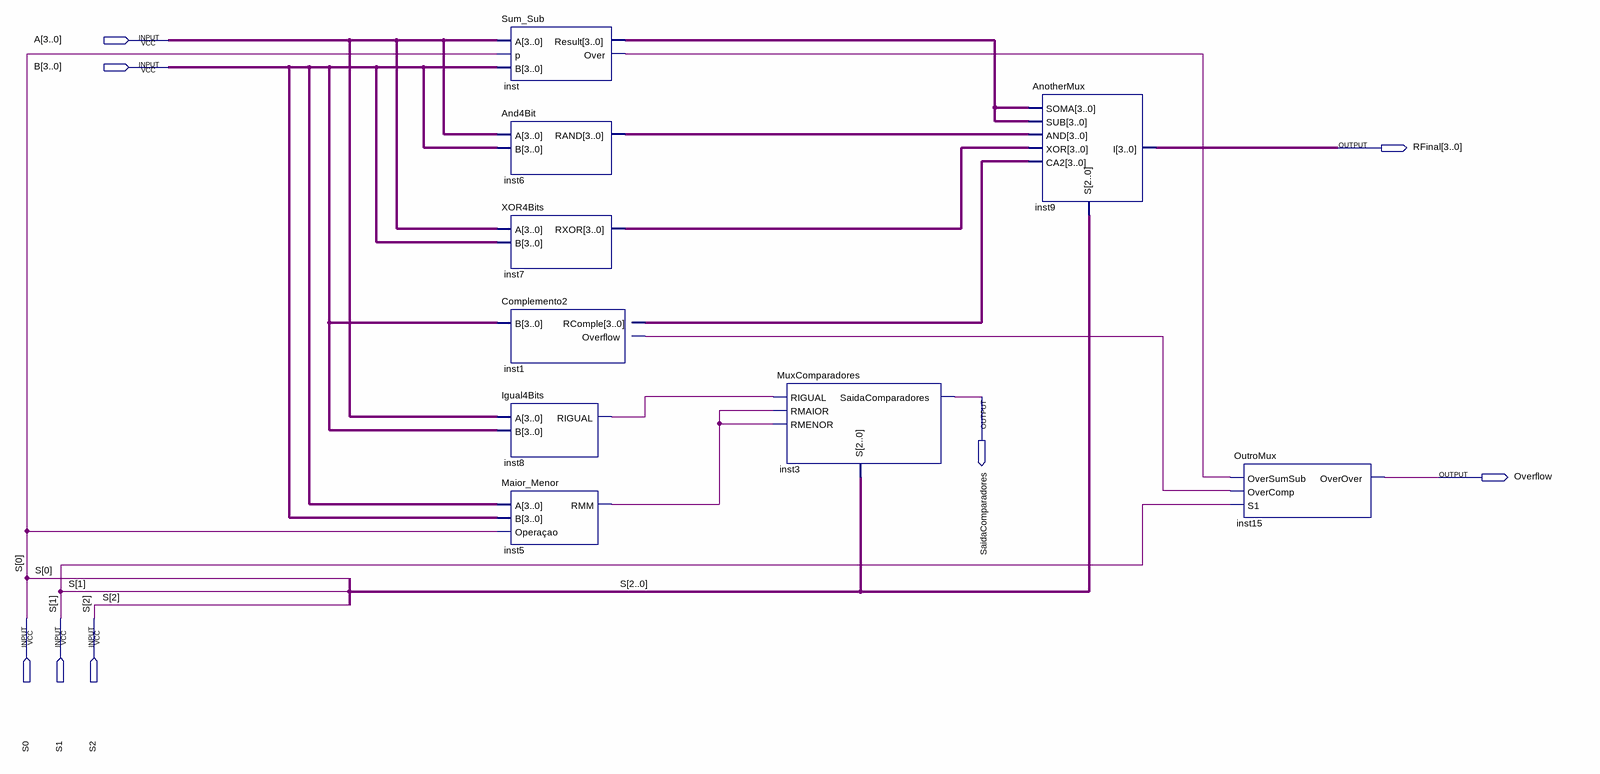
[diagram p0: schematic sheet]
// Quartus schematic ULATOR.bdf as structural Verilog: 9 symbols, 8 pins
module ULATOR (
  input  [3:0] A,
  input  [3:0] B,
  input  S0,
  input  S1,
  input  S2,
  output [3:0] RFinal,
  output SaidaComparadores,
  output Overflow
);

  wire inst1_overflow, inst5_rmm, inst8_rigual, inst_over;
  wire [3:0] inst1_rcomple, inst6_rand, inst7_rxor, inst_result;

  Sum_Sub inst (.A(A), .p(S0), .B(B), .Result(inst_result), .Over(inst_over));
  And4Bit inst6 (.A(A), .B(B), .RAND(inst6_rand));
  XOR4Bits inst7 (.A(A), .B(B), .RXOR(inst7_rxor));
  Complemento2 inst1 (.B(B), .RComple(inst1_rcomple), .Overflow(inst1_overflow));
  Igual4Bits inst8 (.A(A), .B(B), .RIGUAL(inst8_rigual));
  Maior_Menor inst5 (.A(B), .B(B), .\Operaçao (S0), .RMM(inst5_rmm));
  MuxComparadores inst3 (
    .RMENOR(inst5_rmm), .RMAIOR(inst5_rmm), .RIGUAL(inst8_rigual), .S({S2, S1, S0}),
    .SaidaComparadores(SaidaComparadores));
  AnotherMux inst9 (
    .SOMA(inst_result), .SUB(inst_result), .CA2(inst1_rcomple), .AND(inst6_rand), .XOR(inst7_rxor),
    .S({S2, S1, S0}), .I(RFinal));
  OutroMux inst15 (.OverSumSub(inst_over), .S1(S1), .OverComp(inst1_overflow), .OverOver(Overflow));
endmodule
